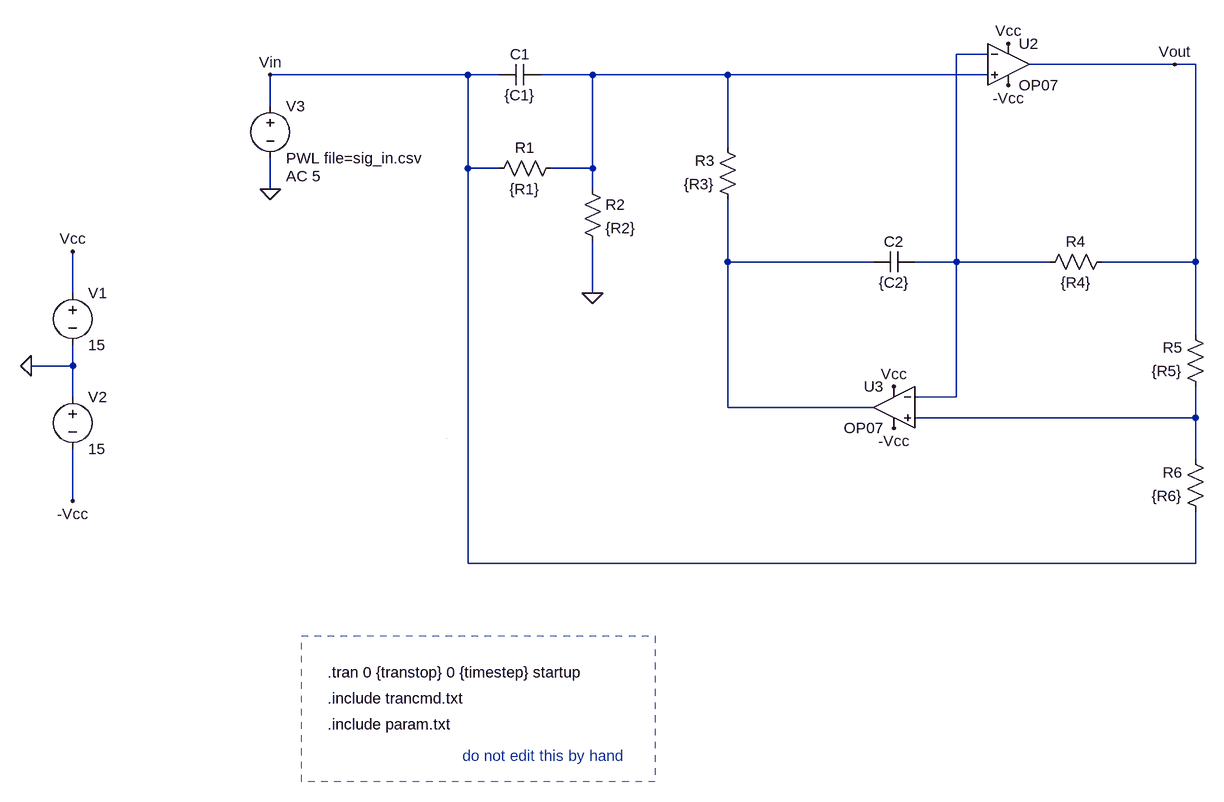
[diagram p0: schematic A12_Notch_Activo.asc]
A12_Notch_Activo.asc, the LTspice schematic file:
Version 4
SHEET 1 2020 680
WIRE 832 -592 784 -592
WIRE 1120 -576 896 -576
WIRE 1152 -576 1120 -576
WIRE 32 -560 -272 -560
WIRE 80 -560 32 -560
WIRE 224 -560 144 -560
WIRE 432 -560 224 -560
WIRE 832 -560 432 -560
WIRE -272 -512 -272 -560
WIRE 432 -448 432 -560
WIRE 32 -416 32 -560
WIRE 80 -416 32 -416
WIRE 224 -416 224 -560
WIRE 224 -416 160 -416
WIRE -272 -384 -272 -432
WIRE 224 -384 224 -416
WIRE 432 -272 432 -368
WIRE 656 -272 432 -272
WIRE 784 -272 784 -592
WIRE 784 -272 720 -272
WIRE 928 -272 784 -272
WIRE 1152 -272 1152 -576
WIRE 1152 -272 1008 -272
WIRE -576 -224 -576 -288
WIRE 224 -224 224 -304
WIRE 1152 -160 1152 -272
WIRE -576 -112 -576 -144
WIRE -576 -112 -640 -112
WIRE -576 -64 -576 -112
WIRE 784 -64 784 -272
WIRE 784 -64 720 -64
WIRE 432 -48 432 -272
WIRE 656 -48 432 -48
WIRE 1152 -32 1152 -80
WIRE 1152 -32 720 -32
WIRE 1152 32 1152 -32
WIRE -576 96 -576 16
WIRE 32 192 32 -416
WIRE 1152 192 1152 112
WIRE 1152 192 32 192
WIRE 0 0 0 0
FLAG -272 -560 Vin
FLAG -640 -112 0
FLAG -576 -288 Vcc
FLAG -576 96 -Vcc
FLAG -272 -384 0
FLAG 864 -608 Vcc
FLAG 864 -544 -Vcc
FLAG 688 -80 Vcc
FLAG 688 -16 -Vcc
FLAG 224 -224 0
FLAG 1120 -576 Vout
SYMBOL res 176 -432 R90
WINDOW 0 0 56 VBottom 2
WINDOW 3 32 56 VTop 2
SYMATTR InstName R1
SYMATTR Value {R1}
SYMBOL cap 80 -544 R270
WINDOW 0 32 32 VTop 2
WINDOW 3 0 32 VBottom 2
SYMATTR InstName C1
SYMATTR Value {C1}
SYMBOL cap 656 -256 R270
WINDOW 0 32 32 VTop 2
WINDOW 3 0 32 VBottom 2
SYMATTR InstName C2
SYMATTR Value {C2}
SYMBOL voltage -576 -240 R0
WINDOW 123 0 0 Left 0
WINDOW 39 0 0 Left 0
SYMATTR InstName V1
SYMATTR Value 15
SYMBOL voltage -576 -80 R0
WINDOW 123 0 0 Left 0
WINDOW 39 0 0 Left 0
SYMATTR InstName V2
SYMATTR Value 15
SYMBOL voltage -272 -528 R0
WINDOW 123 24 124 Left 2
WINDOW 39 0 0 Left 0
SYMATTR Value2 AC 5
SYMATTR InstName V3
SYMATTR Value PWL file=sig_in.csv
SYMBOL res 208 -400 R0
SYMATTR InstName R2
SYMATTR Value {R2}
SYMBOL res 1024 -288 R90
WINDOW 0 0 56 VBottom 2
WINDOW 3 32 56 VTop 2
SYMATTR InstName R4
SYMATTR Value {R4}
SYMBOL OpAmps\\OP07 864 -640 R0
SYMATTR InstName U2
SYMBOL OpAmps\\OP07 688 -112 M0
SYMATTR InstName U3
SYMBOL res 448 -352 R180
WINDOW 0 36 76 Left 2
WINDOW 3 36 40 Left 2
SYMATTR InstName R3
SYMATTR Value {R3}
SYMBOL res 1168 -64 R180
WINDOW 0 36 76 Left 2
WINDOW 3 36 40 Left 2
SYMATTR InstName R5
SYMATTR Value {R5}
SYMBOL res 1168 128 R180
WINDOW 0 36 76 Left 2
WINDOW 3 36 40 Left 2
SYMATTR InstName R6
SYMATTR Value {R6}
TEXT -184 360 Left 2 !.tran 0 {transtop} 0 {timestep} startup
TEXT -184 440 Left 2 !.include param.txt
TEXT -184 400 Left 2 !.include trancmd.txt
TEXT 24 488 Left 2 ;do not edit this by hand
RECTANGLE Normal 320 528 -224 304 2

The netlist it stands for:
* A12_Notch_Activo.asc
R1 N002 Vin {R1}
C1 Vin N002 {C1}
C2 N003 N001 {C2}
V1 Vcc 0 15
V2 0 -Vcc 15
V3 Vin 0 PWL file=sig_in.csv AC 5
R2 N002 0 {R2}
R4 Vout N001 {R4}
XU2 N002 N001 Vcc -Vcc Vout LT1001  ; OP07, pins In+ In- V+ V- OUT
XU3 N004 N001 Vcc -Vcc N003 LT1001  ; OP07, pins In+ In- V+ V- OUT
R3 N003 N002 {R3}
R5 N004 Vout {R5}
R6 Vin N004 {R6}
.tran 0 {transtop} 0 {timestep} startup
.include param.txt
.include trancmd.txt
* do not edit this by hand
.lib LTC.lib
.backanno
.end

* Results of the author's LTspice run, read from the files saved beside the schematic
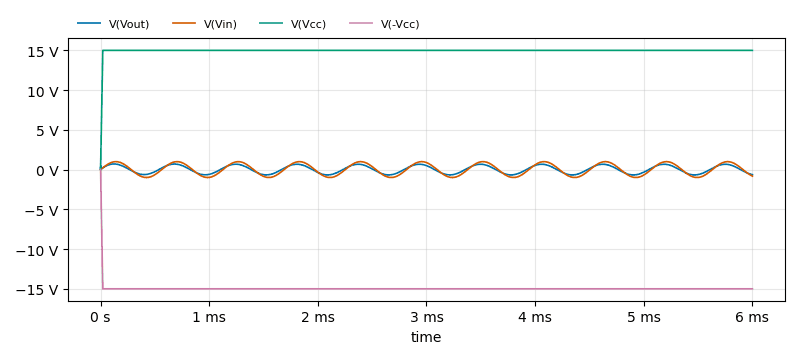
[diagram p1: Transient Analysis of A12_Notch_Activo.asc, plotted from the saved traces]
* Transient Analysis, 1 run:
*   V(Vout): min -673.5 mV, max 708.9 mV, average 18.54 mV, rms 475.4 mV, last -633.9 mV
*   V(Vin): min -1 V, max 1 V, average 23.3 mV, rms 704.1 mV, last -827.5 mV
*   V(Vcc): min 0 V, max 15 V, average 14.98 V, rms 14.98 V, last 15 V
*   V(-Vcc): min -15 V, max 0 V, average -14.98 V, rms 14.98 V, last -15 V